# EAGLE schematic Guri_AVR (EAGLE 7.4.0)
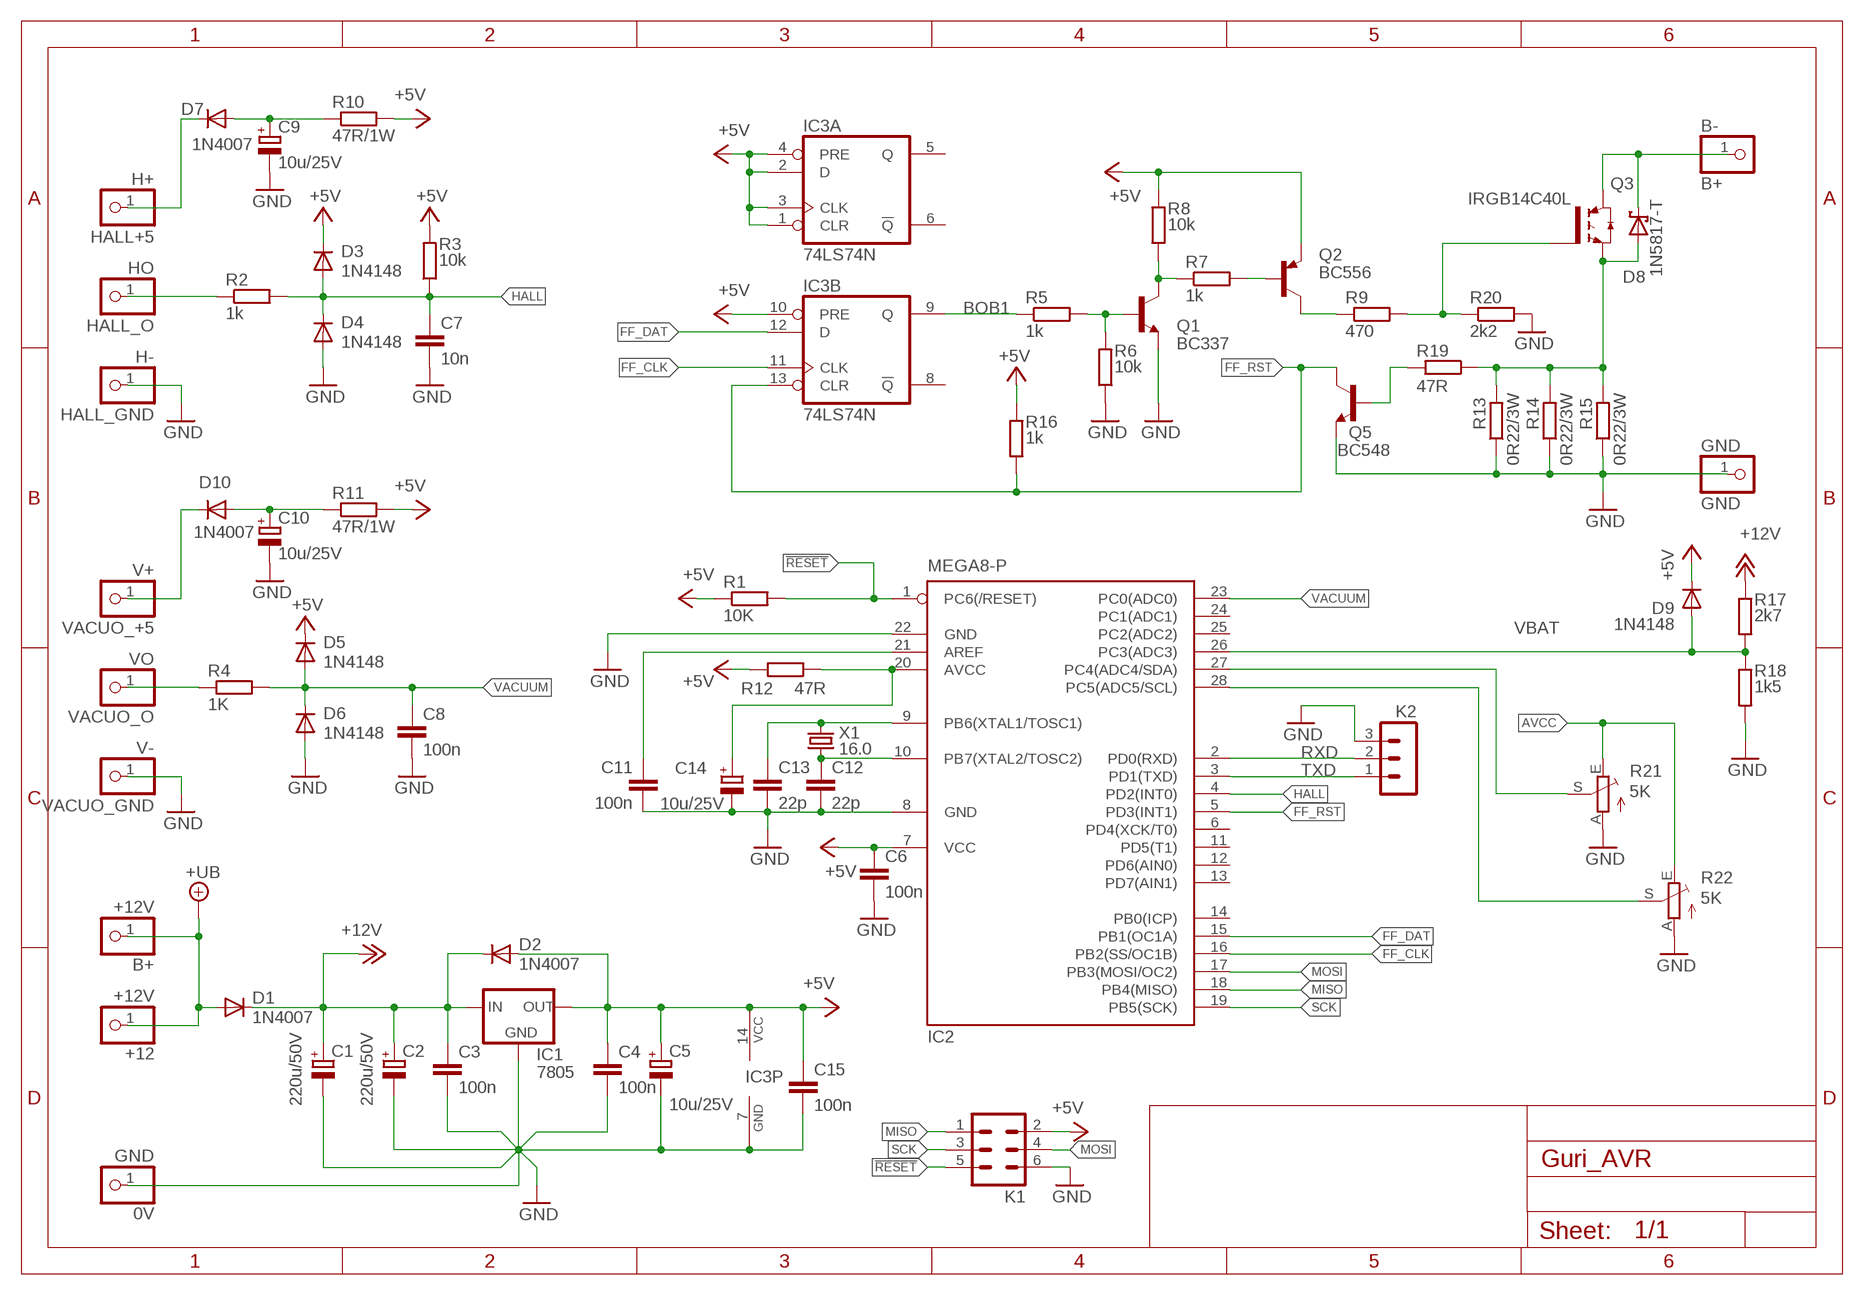
[diagram p0: schematic, sheet 1]

## Parts
0V  GND  PINHD-1X1  [1X01]
+12  +12V  PINHD-1X1  [1X01]
B+  +12V  PINHD-1X1  [1X01]
B-  B+  PINHD-1X1  [1X01]
C1  220u/50V  CPOL-EUE5-10.5  [E5-10,5]
C2  220u/50V  CPOL-EUE5-10.5  [E5-10,5]
C3  100n  C-EU050-025X075  [C050-025X075]
C4  100n  C-EU050-025X075  [C050-025X075]
C5  10u/25V  CPOL-EUE2-5  [E2-5]
C6  100n  C-EU050-025X075  [C050-025X075]
C7  10n  C-EU050-025X075  [C050-025X075]
C8  100n  C-EU050-025X075  [C050-025X075]
C9  10u/25V  CPOL-EUE2-5  [E2-5]
C10  10u/25V  CPOL-EUE2-5  [E2-5]
C11  100n  C-EU050-025X075  [C050-025X075]
C12  22p  C-EU050-024X044  [C050-024X044]
C13  22p  C-EU050-024X044  [C050-024X044]
C14  10u/25V  CPOL-EUE2-5  [E2-5]
C15  100n  C-EU050-025X075  [C050-025X075]
D1  1N4007  DIODE-D-7.5  [D-7.5]
D2  1N4007  DIODE-D-7.5  [D-7.5]
D3  1N4148  1N4148DO35-7  [DO35-7]
D4  1N4148  1N4148DO35-7  [DO35-7]
D5  1N4148  1N4148DO35-7  [DO35-7]
D6  1N4148  1N4148DO35-7  [DO35-7]
D7  1N4007  DIODE-D-7.5  [D-7.5]
D8  1N5817-T  [DO41-7.6]
D9  1N4148  1N4148DO35-7  [DO35-7]
D10  1N4007  DIODE-D-7.5  [D-7.5]
GND  GND  PINHD-1X1  [1X01]
H+  HALL+5  PINHD-1X1  [1X01]
H-  HALL_GND  PINHD-1X1  [1X01]
HO  HALL_O  PINHD-1X1  [1X01]
IC1  7805  78XXS  [78XXS]
IC2  MEGA8-P  [DIL28-3]
IC3  74LS74N  [DIL14]
K1  ML6  [ML6]
K2  MA03-1  [MA03-1]
Q1  BC337  BC338  [TO92-EBC]
Q2  BC556  [TO92-EBC]
Q3  IRGB14C40L  IRG4BC15UD--L  [TO262-V]
Q5  BC548  BC338  [TO92-EBC]
R1  10K  R-EU_0207/7L  [0207/7L]
R2  1k  R-EU_0207/7L  [0207/7L]
R3  10k  R-EU_0207/7L  [0207/7L]
R4  1K  R-EU_0207/7L  [0207/7L]
R5  1k  R-EU_0207/7L  [0207/7L]
R6  10k  R-EU_0207/7L  [0207/7L]
R7  1k  R-EU_0207/7L  [0207/7L]
R8  10k  R-EU_0207/7L  [0207/7L]
R9  470  R-EU_0207/7L  [0207/7L]
R10  47R/1W  R-EU_0207/7L  [0207/7L]
R11  47R/1W  R-EU_0207/7L  [0207/7L]
R12  47R  R-EU_0207/7L  [0207/7L]
R13  0R22/3W  R-EU_0309/10  [0309/10]
R14  0R22/3W  R-EU_0309/10  [0309/10]
R15  0R22/3W  R-EU_0309/10  [0309/10]
R16  1k  R-EU_0207/7L  [0207/7L]
R17  2k7  R-EU_0207/7L  [0207/7L]
R18  1k5  R-EU_0207/7L  [0207/7L]
R19  47R  R-EU_0207/7L  [0207/7L]
R20  2k2  R-EU_0207/7L  [0207/7L]
R21  5K  TRIM_EU-ECP10P  [ECP10P]
R22  5K  TRIM_EU-ECP10P  [ECP10P]
V+  VACUO_+5  PINHD-1X1  [1X01]
V-  VACUO_GND  PINHD-1X1  [1X01]
VO  VACUO_O  PINHD-1X1  [1X01]
X1  16.0  CRYSTALHC49S  [HC49/S]

## Nets
!RESET: IC2.1(PC6(/RESET)) K1.5 R1.4
+5V: C4.1 C5.+ C6.1 C15.1 D2.A D3.C D5.C D9.C IC1.OUT IC2.7(VCC) IC3.1(A:CLR) IC3.2(A:D) IC3.3(A:CLK) IC3.4(A:PRE) IC3.10(B:PRE) IC3.14(P:VCC) K1.2 Q2.E R1.3 R3.4 R8.4 R10.4 R11.4 R12.4 R16.4
+12V: C1.+ C2.+ C3.1 D1.C D2.C IC1.IN R17.3
+UB: +12.1 B+.1 D1.A
AREF: C11.1 IC2.21(AREF)
AVCC: C14.+ IC2.20(AVCC) R12.3 R21.E R22.E
BOB1: IC3.9(B:Q) R5.3
FF_CLK: IC2.16(PB2(SS/OC1B)) IC3.11(B:CLK)
FF_DAT: IC2.15(PB1(OC1A)) IC3.12(B:D)
FF_RST: IC2.5(PD3(INT1)) IC3.13(B:CLR) Q5.C R16.3
GND: 0V.1 C1.- C2.- C3.2 C4.2 C5.- C6.2 C7.2 C8.2 C9.- C10.- C11.2 C12.2 C13.2 C14.- C15.2 D4.A D6.A GND.1 H-.1 IC1.GND IC2.8(GND) IC2.22(GND) IC3.7(P:GND) K1.6 K2.3 Q1.E Q5.E R6.3 R13.1 R14.1 R15.1 R18.4 R20.4 R21.A R22.A V-.1
HALL: C7.1 D3.A D4.C IC2.4(PD2(INT0)) R2.4 R3.3
HALL_IN: HO.1 R2.3
MISO: IC2.18(PB4(MISO)) K1.1
MOSI: IC2.17(PB3(MOSI/OC2)) K1.4
N$1: C9.+ D7.A R10.3
N$2: D10.C V+.1
N$3: Q2.B R7.4
N$4: Q1.C R7.3 R8.3
N$5: Q1.B R5.4 R6.4
N$6: C10.+ D10.A R11.3
N$7: D7.C H+.1
N$8: Q2.C R9.3
N$9: Q3.1(G) R9.4 R20.3
N$10: B-.1 D8.C Q3.2(C)
N$11: C13.1 IC2.9(PB6(XTAL1/TOSC1)) X1.2
N$12: C12.1 IC2.10(PB7(XTAL2/TOSC2)) X1.1
N$13: Q5.B R19.4
N$16: IC2.27(PC4(ADC4/SDA)) R21.S
N$17: IC2.28(PC5(ADC5/SCL)) R22.S
N$19: D8.A Q3.3(E) R13.2 R14.2 R15.2 R19.3
RXD: IC2.2(PD0(RXD)) K2.2
SCK: IC2.19(PB5(SCK)) K1.3
TXD: IC2.3(PD1(TXD)) K2.1
VAC-IN: R4.3 VO.1
VACUUM: C8.1 D5.A D6.C IC2.23(PC0(ADC0)) R4.4
VBAT: D9.A IC2.26(PC3(ADC3)) R17.4 R18.3
Unconnected: IC2.6(PD4(XCK/T0)) IC2.11(PD5(T1)) IC2.12(PD6(AIN0)) IC2.13(PD7(AIN1)) IC2.14(PB0(ICP)) IC2.24(PC1(ADC1)) IC2.25(PC2(ADC2)) IC3.5(A:Q) IC3.6(A:!Q) IC3.8(B:!Q)

## Library data of the parts
0V +12 B+ B- GND H+ H- HO V+ V- VO = pinhead:PINHD-1X1: PIN HEADER
C1 C2 C5 C9 C10 C14 = rcl:CPOL-EU: POLARIZED CAPACITOR, European symbol
C3 C4 C6-C8 C11-C13 C15 = rcl:C-EU: CAPACITOR, European symbol
D1 D2 D7 D10 = diode:DIODE-: DIODE
D3-D6 D9 = diode:1N4148: DIODE high speed (Philips)
D8 = diode:1N581*: 1.0A SCHOTTKY BARRIER RECTIFIER Source: http://www.diodes.com/datasheets/ds23001.pdf
IC1 = v-reg:78XXS: VOLTAGE REGULATOR
IC2 = atmel:MEGA8-P: MICROCONTROLLER 8 Kbytes FLASH, 1 kbytes SRAM, 512 bytes EEPROM, USART, 4-channel 10 bit ADC, 2-channel 8 bit ADC Pin compatible with Atmega48, ATMega88, ATMega168 Source: avr.lbr; OC_FARNELL: unknown; OC_NEWARK: unknown
IC3 = 74xx-us:74*74: Dual D type positive edge triggered FLIP FLOP, preset and clear
K1 = con-ml:ML6: HARTING; OC_FARNELL: unknown; OC_NEWARK: unknown
K2 = con-lstb:MA03-1: PIN HEADER; OC_FARNELL: unknown; OC_NEWARK: unknown
Q1 Q5 = transistor-npn:BC338*: NPN Transistor
Q2 = transistor-pnp:BC556*: PNP Transistror
Q3 = transistor-power:IRG4BC15UD-: INSULATED GATE BIPOLAR TRANSISTOR WITH ULTRAFAST SOFT RECOVERY DIODE
R1-R20 = rcl:R-EU_: RESISTOR, European symbol
R21 R22 = pot:TRIM_EU-: POTENTIOMETER
X1 = crystal:CRYSTAL: CRYSTAL; OC_FARNELL: 1667008; OC_NEWARK: unknown